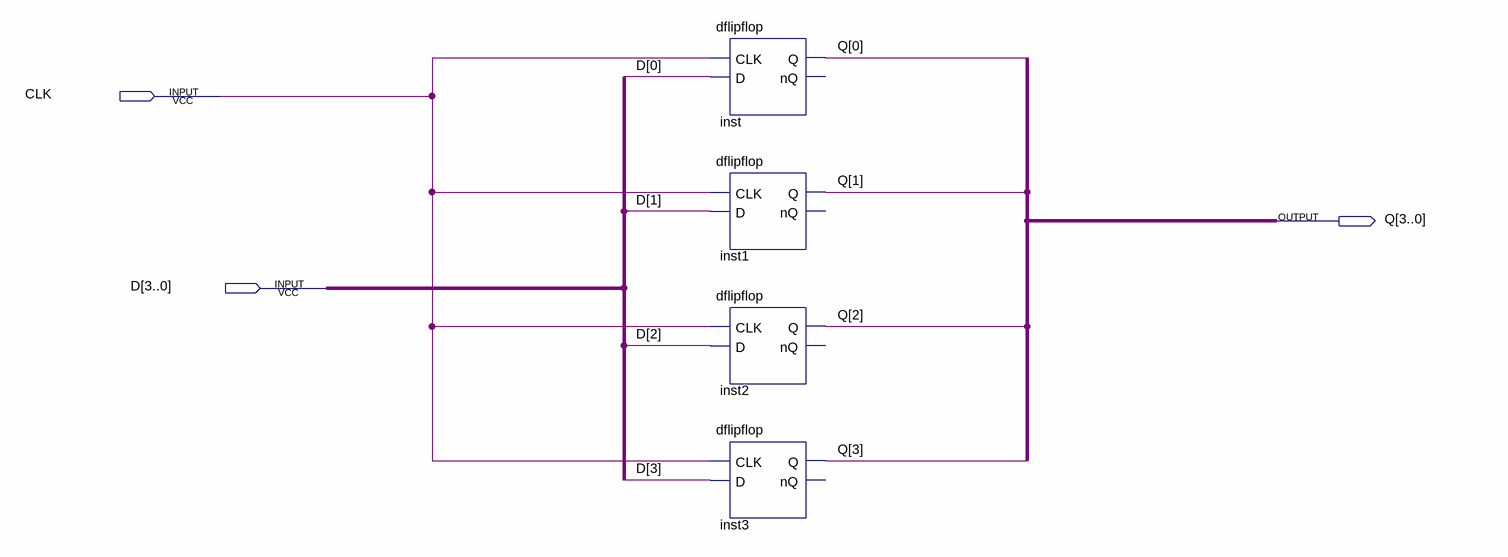
[diagram p0: schematic sheet]
// Quartus schematic actualdflipflop.bdf as structural Verilog: 4 symbols, 3 pins
module actualdflipflop (
  input  CLK,
  input  [3:0] D,
  output [3:0] Q
);

  dflipflop inst (.CLK(CLK), .D(D[0]), .Q(Q[0]));  // open: nQ
  dflipflop inst1 (.CLK(CLK), .D(D[1]), .Q(Q[1]));  // open: nQ
  dflipflop inst2 (.CLK(CLK), .D(D[2]), .Q(Q[2]));  // open: nQ
  dflipflop inst3 (.CLK(CLK), .D(D[3]), .Q(Q[3]));  // open: nQ
endmodule
